# Altium project AVR ICSP.PrjPcb
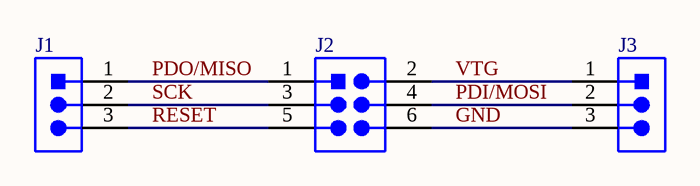
[diagram p0: Top Sheet.SchDoc]

1 sheet, 3 parts. Net scope: global (net labels, ports and power ports of the same name join across sheets).
Board file: AVR ICSP.PcbDoc

## Sheet Top Sheet.SchDoc
size Letter; Address4: USA

### Parts
J1  3 contacts Male header  [10129380-903001ALF]  (value not drawn)
J2  AVR ICSP  [3020-06-0300-00 ICSP AVR ICE NEW]  (value not drawn)
J3  3 contacts Male header  [10129380-903001ALF]  (value not drawn)

### Nets
~{RESET}: J1.3 J2.5(~{RESET})
GND: J2.6(GND) J3.3
PDI/MOSI: J2.4(PDI/MOSI) J3.2
PDO/MISO: J1.1 J2.1(PDO/MISO)
SCK: J1.2 J2.3(SCK)
VTG: J2.2(VTG_(VCC)) J3.1

### Notes on the sheet
- Title:
- Desc:
- Size:
- Date:
- File:
- Repo:
- Letter
- Auth:
- Time:
- Sheet
- Proj:
- of

### Library data of the parts
J1 J3 = 10129380-903001ALF: Connector Male Header 1X3 vertical 3contacts 0.100in pitch Gold finish SMD; Manufacturer: FCI; Description in Visual: Con Hdr Male 3contacts vertical 1X3; Number of Contacts: 3; P/N: 10129380-903001ALF; Manufacturer P/N: 10129380-903001ALF; PCB Package: 10129380-903001ALF; Orientation: vertical; Number of Rows: 1; Pitch: 0.100in; Contact Finish: Gold; Gender: Male; ComponentLink1Description: Manufacturer Website; ComponentLink1URL: http://www.fci.com; ComponentLink2Description: Component Datasheet; ComponentLink2URL: https://cdn.amphenol-icc.com/media/wysiwyg/files/drawing/10129380.pdf; ComponentLink3Description: Octopart Link; ComponentLink3URL: https://octopart.com/10129380-903001alf-amphenol+icc+%2F+fci-87314036?r=sp; Supplier 1: Digi-Key; Supplier Part Number 1: 10129380-903001ALF-ND
J2 = AVR ICSP SHROUD SMD: AVR Serial ICSP, Shrouded, SMD - 6 Pin Shrouded Header, 0.100", SMD; Manufacturer: CNC Tech; Manufacturer P/N: 3020-06-0300-00; Number of Contacts: 6; Gender: Male; P/N: AVR ICSP SHROUD SMD; Description in Visual: AVR Serial ICSP, Shrouded, SMD - 6 Pin Shrouded Header, 0.100", SMD; Orientation: Vertical; Number of Rows: 2; Pitch: 0.100"; Contact Finish: Gold; ComponentLink1Description: Pinout Reference; ComponentLink1URL: http://ww1.microchip.com/downloads/en/DeviceDoc/Atmel-ICE_UserGuide.pdf; ComponentLink2Description: Datasheet for Connector; ComponentLink2URL: http://www.cnctech.us/pdfs/3020-XX-0300-00-TR.pdf; Supplier 1: Digi-Key; Supplier Part Number 1: 3020-06-0300-00